# EAGLE design Adafruit ItsyBitsy nRF52840 Express (EAGLE 9.5.1)
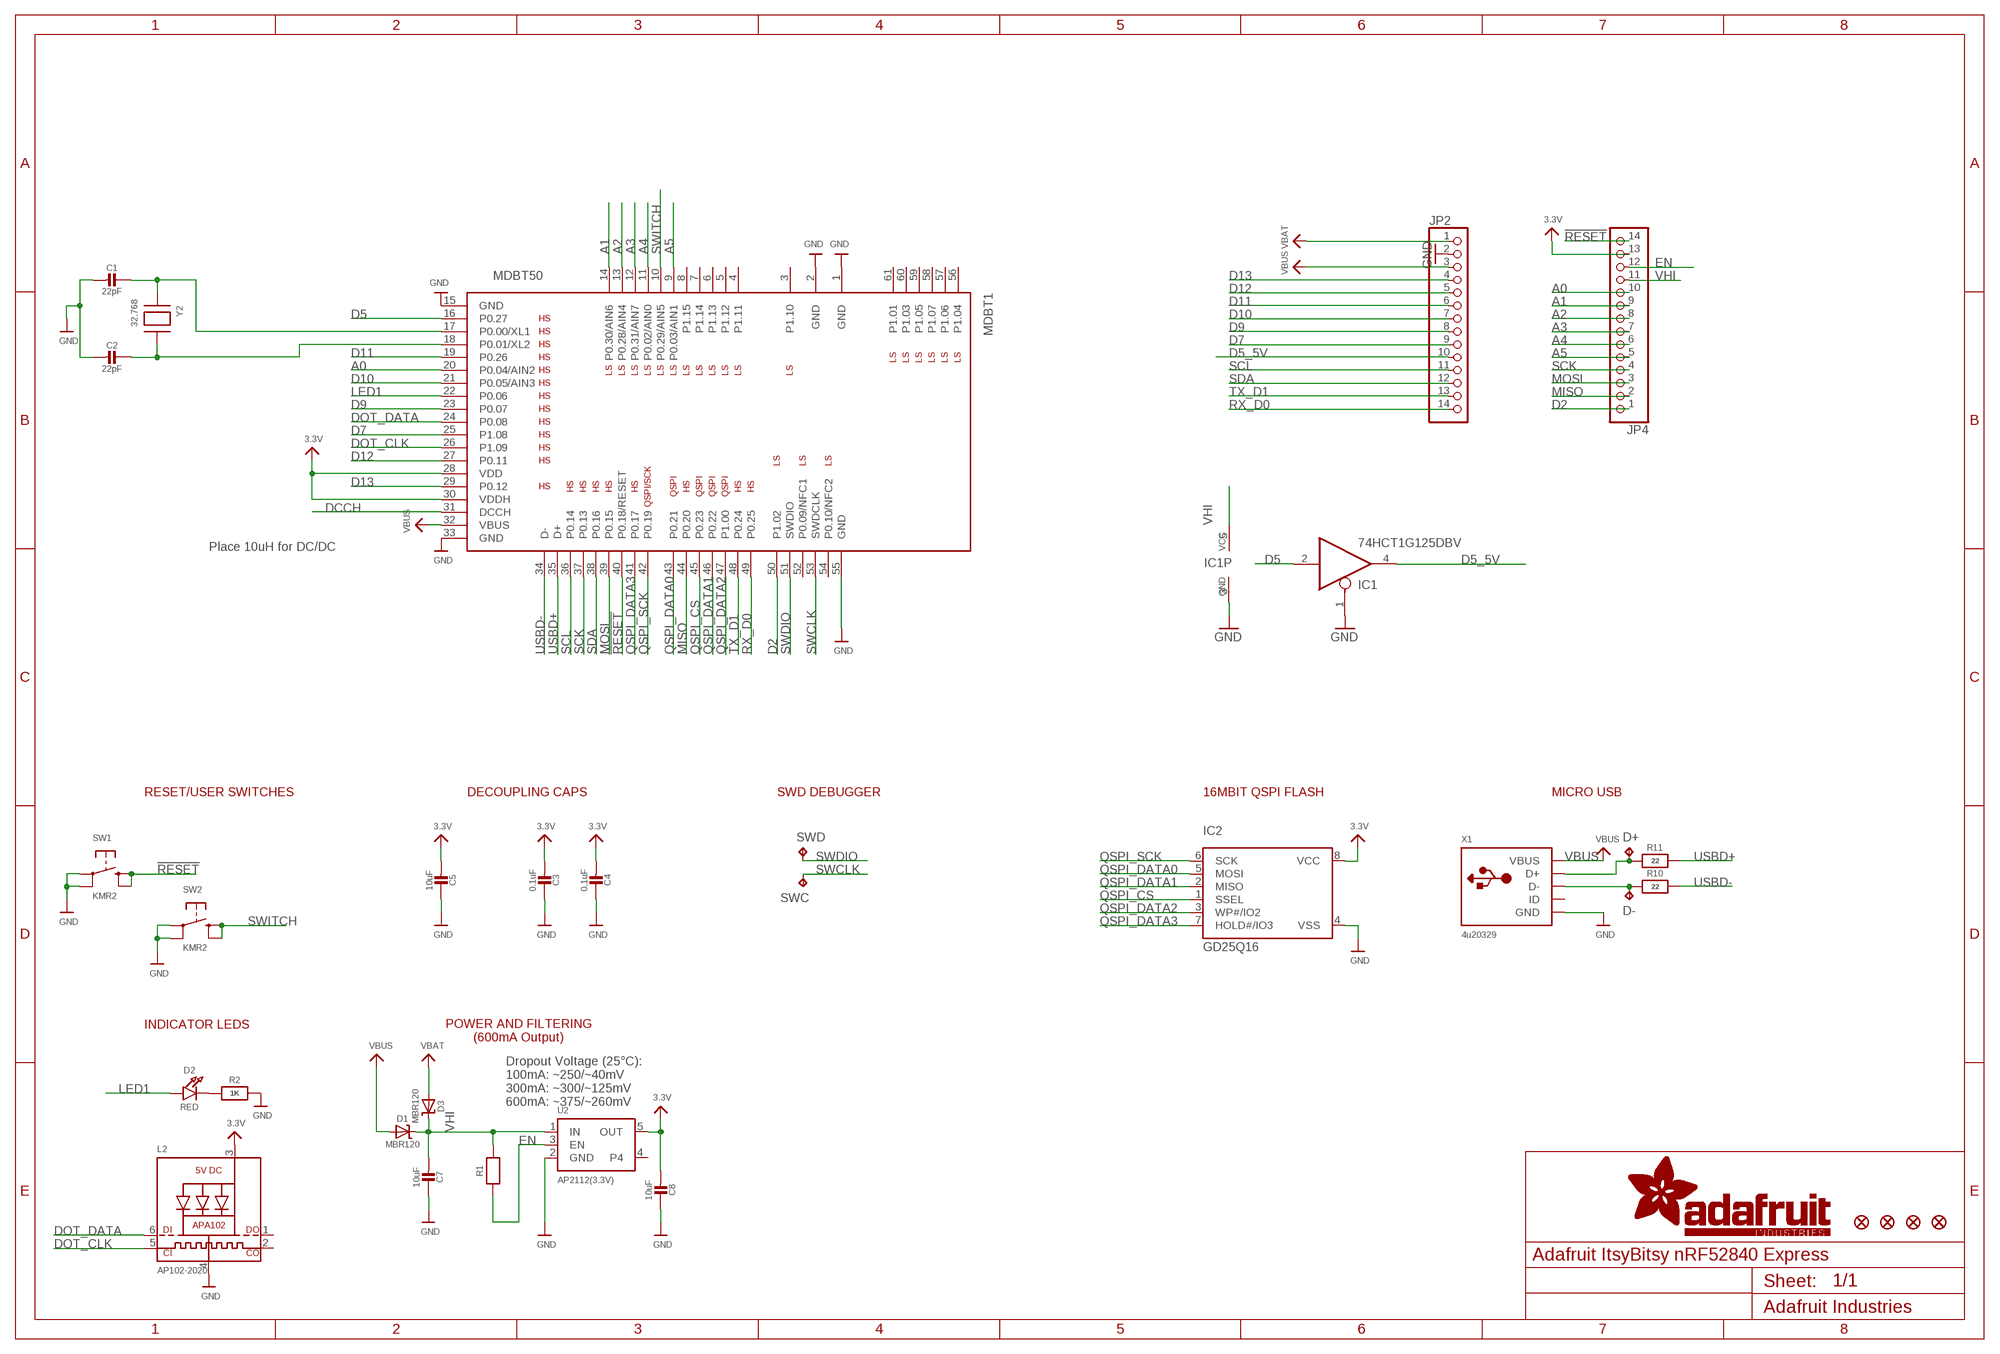
[diagram p0: schematic, sheet 1]

## Parts
C1  22pF  CAP_CERAMIC_0603MP  [_0603MP]
C2  22pF  CAP_CERAMIC_0603MP  [_0603MP]
C3  0.1uF  CAP_CERAMIC0603_NO  [0603-NO]
C4  0.1uF  CAP_CERAMIC0603_NO  [0603-NO]
C5  10uF  CAP_CERAMIC0805-NOOUTLINE  [0805-NO]
C7  10uF  CAP_CERAMIC0805-NOOUTLINE  [0805-NO]
C8  10uF  CAP_CERAMIC0805-NOOUTLINE  [0805-NO]
D1  MBR120  DIODE-SCHOTTKYSOD-123  [SOD-123]
D2  RED  LED0805_NOOUTLINE  [CHIPLED_0805_NOOUTLINE]
D3  MBR120  DIODE-SCHOTTKYSOD-123  [SOD-123]
D+  TPTP10R  [TP10R]
D-  TPTP10R  [TP10R]
FID1  FIDUCIAL_1MM  [FIDUCIAL_1MM]
FID2  FIDUCIAL_1MM  [FIDUCIAL_1MM]
FID3  FIDUCIAL_1MM  [FIDUCIAL_1MM]
FID4  FIDUCIAL_1MM  [FIDUCIAL_1MM]
IC1  74HCT1G125DBV  74AHC1G125DBV  [SOT23-5]
IC2  GD25Q16  SPIFLASH_8PINUX  [USON8]
JP2  HEADER-1X14  [1X14_ROUND70]
JP4  HEADER-1X14  [1X14_ROUND70]
L2  AP102-2020  APA1022020  [APA102_2020]
MDBT1  MDBT50  [MDBT50]
R1  10K  RESISTOR_0603_NOOUT  [0603-NO]
R2  1K  RESISTOR_0603_NOOUT  [0603-NO]
R10  22  RESISTOR_0603_NOOUT  [0603-NO]
R11  22  RESISTOR_0603_NOOUT  [0603-NO]
SW1  KMR2  SWITCH_TACT_SMT4.6X2.8  [BTN_KMR2_4.6X2.8]
SW2  KMR2  SWITCH_TACT_SMT4.6X2.8  [BTN_KMR2_4.6X2.8]
SWC  TPTP13R  [TP13R]
SWD  TPTP13R  [TP13R]
U2  AP2112(3.3V)  VREG_SOT23-5  [SOT23-5]
X1  4u20329  USB_MICRO_20329_V2  [4UCONN_20329_V2]
Y2  32.768  XTAL-3.2X1.5  [XTAL3215]

## Nets
3.3V [power]: C3.2 C4.2 C5.2 C8.2 IC2.8(VCC) JP4.13 L2.3(VDD) MDBT1.28(VDD) MDBT1.30(VDDH) U2.5(OUT)
!RESET: JP4.14 MDBT1.40(P0.18/RESET) SW1.B'(S1) SW1.B(S)
A0: JP4.10 MDBT1.20(P0.04/AIN2)
A1: JP4.9 MDBT1.14(P0.30/AIN6)
A2: JP4.8 MDBT1.13(P0.28/AIN4)
A3: JP4.7 MDBT1.12(P0.31/AIN7)
A4: JP4.6 MDBT1.11(P0.02/AIN0)
A5: JP4.5 MDBT1.9(P0.03/AIN1)
D2: JP4.1 MDBT1.50(P1.02)
D5: IC1.2(I) MDBT1.16(P0.27)
D5_5V: IC1.4(O) JP2.10
D7: JP2.9 MDBT1.25(P1.08)
D9: JP2.8 MDBT1.23(P0.07)
D10: JP2.7 MDBT1.21(P0.05/AIN3)
D11: JP2.6 MDBT1.19(P0.26)
D12: JP2.5 MDBT1.27(P0.11)
D13: JP2.4 MDBT1.29(P0.12)
D+: D+.TP R11.1 X1.D+
D-: D-.TP R10.1 X1.D-
DCCH: MDBT1.31(DCCH)
DOT_CLK: L2.5(CKI) MDBT1.26(P1.09)
DOT_DATA: L2.6(DI) MDBT1.24(P0.08)
EN: JP4.12 R1.1 U2.3(EN)
GND: C1.2 C2.2 C3.1 C4.1 C5.1 C7.1 C8.1 IC1.1(OE) IC1.3(GND) IC2.4(VSS) JP2.2 L2.4(GND) MDBT1.1(GND) MDBT1.2(GND) MDBT1.15(GND) MDBT1.33(GND) MDBT1.55(GND) R2.2 SW1.A'(P1) SW1.A(P) SW2.A'(P1) SW2.A(P) U2.2(GND) X1.BASE@1(GND) X1.BASE@2(GND) X1.GND X1.SPRT@1(GND) X1.SPRT@2(GND) X1.SPRT@3(GND) X1.SPRT@4(GND)
LED1: D2.A MDBT1.22(P0.06)
MISO: JP4.2 MDBT1.44(P0.20)
MOSI: JP4.3 MDBT1.39(P0.15)
N$1: D2.C R2.1
N$7: C1.1 MDBT1.17(P0.00/XL1) Y2.P$1
N$8: C2.1 MDBT1.18(P0.01/XL2) Y2.P$2
QSPI_CS: IC2.1(SSEL) MDBT1.45(P0.23)
QSPI_DATA0: IC2.5(MOSI) MDBT1.43(P0.21)
QSPI_DATA1: IC2.2(MISO) MDBT1.46(P0.22)
QSPI_DATA2: IC2.3(WP#/IO2) MDBT1.47(P1.00)
QSPI_DATA3: IC2.7(HOLD#/IO3) MDBT1.41(P0.17)
QSPI_SCK: IC2.6(SCK) MDBT1.42(P0.19)
RX_D0: JP2.14 MDBT1.49(P0.25)
SCK: JP4.4 MDBT1.37(P0.13)
SCL: JP2.11 MDBT1.36(P0.14)
SDA: JP2.12 MDBT1.38(P0.16)
SWCLK: MDBT1.53(SWDCLK) SWC.TP
SWDIO: MDBT1.51(SWDIO) SWD.TP
SWITCH: MDBT1.10(P0.29/AIN5) SW2.B'(S1) SW2.B(S)
TX_D1: JP2.13 MDBT1.48(P0.24)
USBD+: MDBT1.35(D+) R11.2
USBD-: MDBT1.34(D-) R10.2
VBAT [power]: D3.A JP2.1
VBUS [power]: D1.A JP2.3 MDBT1.32(VBUS) X1.VBUS
VHI [power]: C7.2 D1.C D3.C IC1.5(VCC) JP4.11 R1.2 U2.1(IN)
Unconnected: L2.1(DO) L2.2(CKO) MDBT1.3(P1.10) MDBT1.4(P1.11) MDBT1.5(P1.12) MDBT1.6(P1.13) MDBT1.7(P1.14) MDBT1.8(P1.15) MDBT1.52(P0.09/NFC1) MDBT1.54(P0.10/NFC2) MDBT1.56(P1.04) MDBT1.57(P1.06) MDBT1.58(P1.07) MDBT1.59(P1.05) MDBT1.60(P1.03) MDBT1.61(P1.01) U2.4 X1.ID

## Notes on the sheet
- Place 10uH for DC/DC
- RESET/USER SWITCHES | DECOUPLING CAPS | SWD DEBUGGER | 16MBIT QSPI FLASH | MICRO USB
- INDICATOR LEDS
- POWER AND FILTERING
  (600mA Output)
- Dropout Voltage (25°C):
  100mA: ~250/~40mV
  300mA: ~300/~125mV
  600mA: ~375/~260mV

## Library data of the parts
C1-C5 C7 C8 = microbuilder:CAP_CERAMIC: Ceramic Capacitors For new designs, use the packages preceded by an '_' character since they are more reliable: The following footprints should be used on most boards: _0402 - Standard footprint for regular board layouts _0603 - Standard footprint for regular board layouts _0805 - Standard footprint for regular board layouts _1206 - Standard footprint for regular board layouts For extremely tight-pitch boards where space is at a premium, the following 'micro-pitch' footprints can be used (smaller pads, no silkscreen outline, etc.): _0402MP - Micro-pitch footprint for very dense/compact boards _0603MP - Micro-pitch footprint for very dense/compact boards _0805MP - Micro-pitch footprint for very dense/compact boards _1206MP - Micro-pitch footprint for very dense/compact boards
D1 D3 = microbuilder:DIODE-SCHOTTKY
D2 = microbuilder:LED: LED 0603 - 0603 Surface Mount Package 2mA: Green LED - Low Power (3.9mcd, 2ma, 1.7Vf) - Digikey: 475-2709-2-ND Orange LED - Low Power (9.8mcd, 2ma, 1.8Vf) - Digikey: 475-1194-2-ND Red LED - Low Power (5mcd, 2ma, 1.8Vf) - Digikey: 475-1195-2-ND Yellow LED - Low Power (7mcd, 2ma, 1.8Vf) - Digikey: 475-1196-2-ND 5mA: Blue LED - Low Power (17mcd, 5ma, 2.9Vf) - Digikey: LNJ937W8CRACT-ND 0805 - 0805 Surface Mount Package 2mA: Red LED (8.8mcd, 2mA, 1.8Vf, Clear) - Low Power [Digikey: 475-2510-1-ND] Green LED (5mcd, 2mA, 1.8Vf, Clear) - Low Power [Digikey: 475-2730-1-ND] Yellow LED (11.3mcd, 2mA, 1.8Vf, Clear) - Low Power [Digikey: 475-2555-1-ND] 20mA: Red LED (104mcd, 20mA, Diffused) - LS R976 [Digikey: 475-1278-6-ND] Red LED (12mcd, 20mA, 2.0Vf, Clear) - APT2012EC [Digikey: 754-1128-1-ND] Green LED (15mcd, 20mA, 2.2Vf, Clear) - APT2012GC [Digikey: 754-1131-1-ND] Orange LED (160mcd, 20mA, 2.1Vf, Clear) - APT2012SECK [Digikey: 754-1130-1-ND] 1206 - 1206 Surface Mount Package Green LED (26mcd, 20mA, Diffused) - LG N971 [Digikey: 475-1407-6-ND] Red LED (15mcd, 20mA, Diffused) - LH N974 [Digikey: 475-1416-6-ND] Cree - Cree High-Power Surface Mount LEDs XPEBWT-L1-0000-00D50 - White 111lm 350mA 2.9Vf 6200K 110° XTEAWT-00-0000-00000LEE3 - White 114lm 350mA 2.85Vf 5000K 115° Everlight - Everlight 45-21 Series Surface Mount LEDs 45-21/QK2C-B2832AC2CB2/2T - Warm White 2000mcd 20mA 3.25Vf 3050K 120° 45-21/LK2C-B38452C4CB2/2T - Nuetral White 2000mcd 20mA 3.25Vf 4150K 120° 45-21/LK2C-B50634C6CB2/2T - Cold White 2200mcd 20mA 3.25Vf 5650K 120° PLCC2 Reverse Mount LS T77K-J1L2-1-0-2-R18-Z - Red 11.25mcd 2mA 1.8Vf 630nm 120° LO T77K-L1M2-24-Z - Orange 19.6mcd 2mA 1.8Vf 606nm 120° LY T77K-K2M1-26-Z - Yellow 15.7mcd 2mA 1.8Vf 587nm 120°
D+ D- SWC SWD = testpad:TP: Test pad
FID1-FID4 = microbuilder:FIDUCIAL: Fiducial Alignment Points Various fiducial points for machine vision alignment.; BOM: EXCLUDE
IC1 = 74xx-little-us:74*1G125: Single Bus Buffer Gate with 3-State Output
IC2 = microbuilder:SPIFLASH_8PIN: SOIC8 SPI Flash Be careful with the size since SOIC8 flash comes in several 'widths' SOIC8 150 mil M25P16 - 16Mbit (2Mbit x 8) Serial Flash (75MHz SPI Bus), Supply: 2.7-3.6V Digikey: SOIC8 - M25P16-VMN6P-ND SOIC8 208 mil W25Q16BVSSIG - 16Mbit (2Mbit x 8) Serial Flash (104MHz SPI Bus), Supply: 2.7-3.6V Digikey: SOIC8 - W25Q16BVSSIG-ND
JP2 JP4 = microbuilder:HEADER-1X14
L2 = microbuilder:APA102: APA102/DotStar Pixels VCC: 5V DC Refresh Rate: 400Hz
MDBT1 = microbuilder:MDBT50: Raytac Corporation MDBT50 Bluetooth Low Energy Module based on Noridc nRF52840 Source: Raytac datasheet
R1 R2 R10 R11 = microbuilder:RESISTOR: Resistors For new designs, use the packages preceded by an '_' character since they are more reliable: The following footprints should be used on most boards: _0402 - Standard footprint for regular board layouts _0603 - Standard footprint for regular board layouts _0805 - Standard footprint for regular board layouts _1206 - Standard footprint for regular board layouts For extremely tight-pitch boards where space is at a premium, the following 'micro-pitch' footprints can be used (smaller pads, no silkscreen outline, etc.): _0402MP - Micro-pitch footprint for very dense/compact boards _0603MP - Micro-pitch footprint for very dense/compact boards _0805MP - Micro-pitch footprint for very dense/compact boards _1206MP - Micro-pitch footprint for very dense/compact boards
SW1 SW2 = microbuilder:SWITCH_TACT_SMT: SMT Tact Switches 6x6mm - Digikey: P12940SCT-ND KMR2 (4.6x2.8mm) - Digikey: 401-1426-1-ND EVQ-PQHB55 - Light Touch, 160GF (4.5x4.5mm) - Digikey: P8090SCT-ND KMT0 - KMT021 NGJ LHS (etc.) IP68/Waterproof - Digikey: CKN10289CT-ND
U2 = microbuilder:VREG_SOT23-5: SOT23-5 Fixed Voltage Regulators Part Current Out V Out V In V Dropout θJA (°C/W) TJ (°C) Digikey Part No. ADP121 150mA 3.3V 3.4-5.5V 0.09V @ 150mA -- -- ADP121-AUJZ33R7CT-ND ADP121 150mA 3.0V 3.1-5.5V 0.09V @ 150mA -- -- ADP121-AUJZ30R7CT-ND ADP122 300mA 3.3V 3.4-5.5V 0.085V @ 300mA -- -- ADP122AUJZ-3.3-R7CT-ND ADP1712 300mA 3.3V 3.5-5.5V 0.17V @ 300mA -- -- ADP1712AUJZ-3.3-R7TR-ND AP7311 (Low Cost) 150mA 3.3V 3.5-6V 0.15V @ 150mA -- -- AP7311-33WG-7DICT-ND LD39015M18R 150mA 1.8V 1.9V-5.5V 0.08V @ 100mA -- -- 497-6977-1-ND LP2985A-33DBVR 150mA 3.3V 3.3-16V 0.28V @ 150mA 206 150 296-18479-1-ND MCP1824T-3302E/OT 300mA 3.3V 3.5V-6V 0.2V @ 300mA -- -- MCP1824T-3302E/OTCT-ND MIC5205-2.5YM5 TR 150mA 2.5V 2.7-16V 0.165V @ 150mA -- -- 576-1257-2-ND MIC5205-3.0YM5 TR 150mA 3.0V 3.2V-16V 0.165V @ 150mA -- -- 576-1258-2-ND MIC5205-3.3YM5 TR 150mA 3.3V 3.5V-16V 0.165V @ 150mA -- -- 576-1259-2-ND TPS780330220 150mA 3.3V+2.2V 3.6-5.5V 250mV Max -- -- 296-23332-1-ND TDA3663/N1,135 100mA 3.3V 3.5-45V 0.18V @ 50mA -- -- 568-5343-1-ND Max operating temp can be calculated using θJA, TJ (max junction temperature), and power in watts. Set the "Maximum Ambient Temperature" until it reaches TJ ("Max Junction Temperature"), which is the absolute limit for safe use of the regulator: Heat Sink Temperature Calculator <http://www.daycounter.com/Calculators/Heat-Sink-Temperature-Calculator.phtml> For example, With 12V source into a 3.3V LP2985 and a 30mA load, we are dissipating (12V-3.3V) * 0.03A = 0.261W. With a θJA of 206 °C/W, a TJ of 150°C, and 261mW we can safely use the chip without a heat sink up to 75°C (=147.1°C Junction Temperature).
X1 = microbuilder:USB: USB Connectors USBMINIB - Surface Mount Female Mini-B USB Connector 4UConnector: 06564
Y2 = adafruit2:XTAL: Low cost SMT crystals, no capacitors included http://www.ladyada.net/library/eagle

## Net classes
1 power: width 0.254 mm

## Board
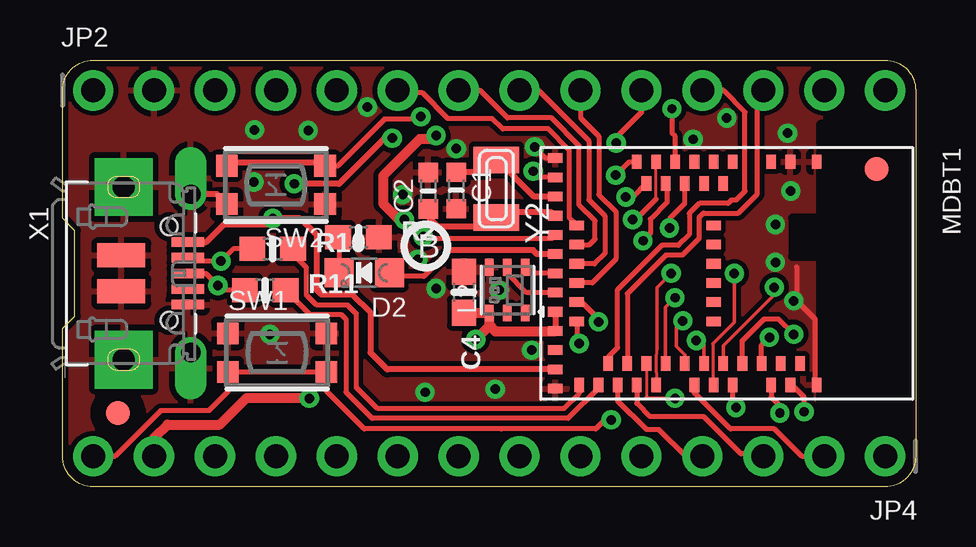
[diagram p1: board, top side]
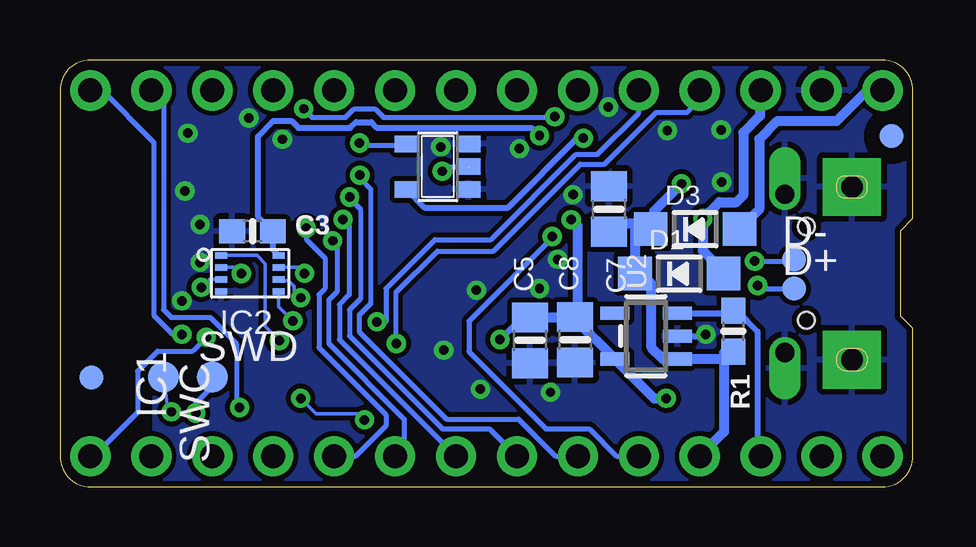
[diagram p2: board, bottom side, seen from below]

Size 35.56 x 17.78 mm. Coordinates in mm from the lower left corner, seen from the top.
Outline: 0,11.18 0,16.51 arc-90 1.27,17.78 34.29,17.78 arc-90 35.56,16.51 35.56,1.27 arc-90 34.29,0 1.27,0 arc-90 0,1.27 0,6.6 0.51,7.11 0.51,10.67 0,11.18
Copper layers (1*16): Top 0.035mm / dielectric 1.5mm / Bottom 0.035mm
Design rules "adafruit 7-7": minimum track width 6mil, minimum drill 15.5mil, track to track 8mil, track to pad 7mil, pad to pad 7mil, via to via 7mil, smd to smd 7mil, copper to edge 10mil, drill to drill 8mil, minimum pad ring 10mil, minimum via ring 8mil, stop-mask expansion 2mil, vias tented up to drill 20mil, thermal gap 10mil

### Footprints (pad centres in the part's own frame; a part is rotated, then mirrored left to right if it is on the bottom)
_0603MP = smd 0.8 x 0.8: 1 -0.762,0; 2 0.762,0
0603-NO = smd 1.075 x 1: 1 -0.85,0; 2 0.85,0
0805-NO = smd 1.24 x 1.5: 1 -0.95,0; 2 0.95,0
SOD-123 = smd 1.4 x 1.4: A 1.85,0; C -1.85,0
CHIPLED_0805_NOOUTLINE = smd 1.2 x 1.2: A 0,-1.05; C 0,1.05
TP10R = smd 1 x 1: TP 0,0
FIDUCIAL_1MM = smd 1 x 1: 1 0,0
SOT23-5 = smd 0.69 x 0.99: 1 -0.95,-1.29; 2 0,-1.29; 3 0.95,-1.29; 4 0.95,1.3; 5 -0.95,1.3
USON8 = smd 0.5 x 0.275: 1 -1.2,0.75; 2 -1.2,0.25; 3 -1.2,-0.25; 4 -1.2,-0.75; 5 1.2,-0.75; 6 1.2,-0.25; 7 1.2,0.25; 8 1.2,0.75
1X14_ROUND70 = drill 1 pad 1.676: 1 -16.51,0; 2 -13.97,0; 3 -11.43,0; 4 -8.89,0; 5 -6.35,0; 6 -3.81,0; 7 -1.27,0; 8 1.27,0; 9 3.81,0; 10 6.35,0; 11 8.89,0; 12 11.43,0; 13 13.97,0; 14 16.51,0
APA102_2020 = smd 0.7 x 0.35: 1 -0.95,-0.75; 2 -0.95,0; 3 -0.95,0.75; 4 0.95,0.75; 5 0.95,0; 6 0.95,-0.75
MDBT50 = smd 0.6 x 0.4: 1 -4.65,3.75; 2 -4.65,2.65; 3 -4.65,1.85; 4 -4.65,0.25; 5 -3.75,-0.15; 6 -4.65,-0.55; 7 -3.75,-0.95; 8 -4.65,-1.35; 9 -3.75,-1.75; 10 -4.65,-2.15; 11 -3.75,-2.55; 12 -4.65,-2.95; 13 -3.75,-3.35; 14 -4.65,-3.75; 34 4.65,-6.15; 35 4.65,-5.35; 36 3.75,-4.95; 37 4.65,-4.55; 38 3.75,-4.15; 39 4.65,-3.75; 40 3.75,-3.35; 41 4.65,-2.95; 42 3.75,-2.55; 43 3.75,-1.75; 44 4.65,-1.35; 45 3.75,-0.95; 46 4.65,-0.55; 47 3.75,-0.15; 48 4.65,0.25; 49 3.75,0.65; 50 3.75,1.45; 51 4.65,1.85; 52 3.75,2.25; 53 4.65,2.65; 54 3.75,3.05; 55 4.65,3.75 | smd 0.4 x 0.6: 15 -4.8,-7.15; 16 -4,-7.15; 17 -3.2,-7.15; 18 -2.4,-7.15; 19 -2,-6.25; 20 -1.6,-7.15; 21 -1.2,-6.25; 22 -0.8,-7.15; 23 -0.4,-6.25; 24 0,-7.15; 25 0.4,-6.25; 26 0.8,-7.15; 27 1.2,-6.25; 28 1.6,-7.15; 29 2,-6.25; 30 2.4,-7.15; 31 3.2,-7.15; 32 4,-7.15; 33 4.8,-7.15; 56 -2,-0.55; 57 -1.2,-0.55; 58 -0.4,-0.55; 59 0.4,-0.55; 60 1.2,-0.55; 61 2,-0.55
BTN_KMR2_4.6X2.8 = smd 0.9 x 0.9: A 2.05,0.8; A' -2.05,0.8; B 2.05,-0.8; B' -2.05,-0.8
TP13R = smd 1.3 x 1.3: TP 0,0
SOT23-5' = smd 0.55 x 1.2: 1 -0.95,-1.3; 2 0,-1.3; 3 0.95,-1.3; 4 0.95,1.3; 5 -0.95,1.3
4UCONN_20329_V2 = smd 1 x 2: BASE@1 -0.75,-2; BASE@2 0.75,-2 | smd 0.4 x 1.35: D+ 0,0.775; D- -0.65,0.775; GND 1.3,0.775; ID 0.65,0.775; VBUS -1.3,0.775 | drill 0.8 pad 1.143 offset: SPRT@1 -3.3,0.9; SPRT@2 3.3,0.9 | drill 0.9 pad 2.413 square: SPRT@3 -3.6,-1.9; SPRT@4 3.6,-1.9 | hole 0.7: -1.95,0; 1.95,0
XTAL3215 = smd 1.1 x 1.9: P$1 1.2,0; P$2 -1.2,0

### Placement (x,y rotation side)
C1  16.41,12.34 270 top
C2  15.24,12.33 90 top
C3  27.53,10.64 0 bottom
C4  16.73,8.1 270 top
C5  15.96,6.1 90 bottom
C7  12.67,11.57 270 bottom
C8  14.08,6.12 90 bottom
D1  9.74,8.88 0 bottom
D2  12.57,8.92 90 top
D3  9.08,10.73 0 bottom
D+  4.95,8.26 0 bottom
D-  4.95,9.46 0 bottom
FID1  2.31,3.07 0 top
FID2  33.93,13.25 0 top
FID3  0.89,14.61 0 bottom
FID4  34.24,4.55 0 bottom
IC1  19.81,13.34 90 bottom
IC2  27.64,8.89 0 bottom
JP2  17.78,16.51 0 top
JP4  17.78,1.27 180 top
L2  18.54,8.19 90 top
MDBT1  27.69,8.89 270 top
R1  7.49,6.48 270 bottom
R2  12.33,10.39 0 top
R10  8.76,9.91 0 top
R11  8.45,8.19 0 top
SW1  8.94,5.59 0 top
SW2  8.89,12.57 180 top
SWC  31.24,4.57 270 bottom
SWD  29.21,4.57 0 bottom
U2  AP2112(3.3V)  [SOT23-5']  11.13,6.27 90 bottom
U$12  [ITSYNRF52840_TOP]  0,0 0 top
U$14  [ITSYNRF52840_BOT]  35.56,0 0 bottom
U$15  [PCBFEAT-REV-040]  15.14,10.03 0 top
X1  4.45,8.89 270 top
Y2  18.08,12.42 90 top

### Tracks (layer width: path | path; a pad name or v marks a point on that pad's centre or on a via)
3.3V  (via drill 0.39)
  Top 0.254: L2.3 17.79,6.72 | 20.52,6.48 MDBT1.30 MDBT1.28 | 17.78,7.25 L2.3 | 17.77,6.64 17.73,6.64 | L2.3 17.77,7.22 | v15.57,14.63 15.57,14.61
  Top 0.406: 17.79,6.72 18.03,6.48 20.52,6.48 | C4.2 17.78,7.25 | JP4.13 3.81,2.03 4.37,2.59 6.55,2.59 7.64,3.68 v10.29,3.68 | v17.22,6.13 17.73,6.64 | 17.77,7.22 17.77,6.64 | 15.57,14.61 15.44,14.48 14.88,14.48 13.36,12.95 13.36,11.8 14.03,11.12 v14.25,11.12
  Bottom 0.254: IC2.8 26.68,9.89 C3.2 27.32,11.28 27.32,14.59 26.67,15.24 25.91,15.24 25.62,14.95 23.46,14.95 23.22,15.19 22.58,15.19 22.35,14.96 15.89,14.95 v15.57,14.63 | U2.5 | 15.94,7.07 C5.2 16.31,7.05 v17.22,6.13 | 14.08,6.98 C8.2 13.98,7.17
  Bottom 0.406: U2.5 10.79,3.68 v10.29,3.68 | 15.94,7.07 C8.2 | 14.08,6.98 U2.5 | 13.98,7.17 13.98,10.86 v14.25,11.12
!RESET  (via drill 0.39)
  Top 0.127: MDBT1.40 24.34,3.73
  Top 0.152: 24.34,3.73 24.38,3.68 v25.53,3.68 | 18.3,2.41 18.29,2.41
  Top 0.203: v22.87,2.79 22.61,2.79 22.23,2.41 18.3,2.41 | 18.29,2.41 12.57,2.41 10.99,4 SW1.B SW1.B' 6.89,3.97 6.1,3.17 4.09,3.17 2.18,1.27 JP4.14
  Bottom 0.152: v25.53,3.68 24.89,3.05 23.13,3.05 v22.87,2.79
A0  (via drill 0.39)
  Top 0.203: MDBT1.20 20.38,10.34 15.13,10.34 v15.04,10.43
  Bottom 0.203: v15.04,10.43 15.04,10.38 18.52,6.9 18.52,5.63 15.3,2.41 13.5,2.41 12.35,1.27 JP4.10
A1  (via drill 0.39)
  Top 0.203: MDBT1.14 23.62,13.54 v23.06,12.98
  Bottom 0.203: v23.06,12.98 23.06,12.85 22.61,12.4 22.61,7.62 23.09,7.14 23.09,6.46 19.45,2.82 16.44,2.82 14.89,1.27 JP4.9
A2  (via drill 0.39)
  Top 0.203: v23.48,12.07 23.77,12.07 MDBT1.13
  Bottom 0.203: v23.48,12.07 23.48,12.01 23.04,11.57 23.04,7.82 23.5,7.37 23.5,6.29 19.62,2.41 17.65,2.41 JP4.8
A3  (via drill 0.39)
  Top 0.127: MDBT1.12 24.74,11.98
  Top 0.203: 24.74,11.98 23.89,11.13 v23.76,11.13
  Bottom 0.203: v23.76,11.13 23.51,10.88 23.51,8 23.91,7.59 23.91,6.13 JP4.7
A4  (via drill 0.39)
  Top 0.203: MDBT1.11 25.2,12.58 25.2,11.85 24.5,11.15 24.5,10.55 v24.19,10.25
  Bottom 0.203: v24.19,10.25 24,10.06 24,8.13 24.36,7.77 24.36,5.97 21.21,2.82 21.21,1.65 JP4.6
A5  (via drill 0.39)
  Top 0.203: v25.3,10.78 25.3,11.16 25.94,11.8 MDBT1.9
  Bottom 0.203: v25.3,10.78 25.3,10.31 24.51,9.53 24.51,8.26 24.77,8 24.77,5.79 21.97,3 21.97,2.54 23.24,1.27 JP4.5
D2  (via drill 0.39)
  Top 0.203: MDBT1.50 29.14,5.89 v29.46,6.22
  Bottom 0.203: v29.46,6.22 30.04,5.65 31.49,5.65 32.33,4.82 32.33,3.11 34.16,1.27 JP4.1
D5  (via drill 0.39)
  Top 0.203: MDBT1.16 19.88,12.89 v19.62,13.14
  Bottom 0.203: v19.62,13.14 19.43,13.34 IC1.2
D5_5V  (via drill 0.39)
  Top 0.203: JP2.10 24.13,15.6 23.08,14.54 v23.08,14.33
  Bottom 0.203: v23.08,14.33 22.97,14.33 22.86,14.22 21.18,14.22 IC1.4
D7
  Top 0.203: MDBT1.25 22.08,8.49 23.06,9.47 23.06,11.47 22.36,12.17 22.36,14.6 21.59,15.37 JP2.9
D9
  Top 0.203: JP2.8 19.84,16.51 21.94,14.41 21.94,11.95 22.6,11.29 22.6,9.71 22.18,9.29 MDBT1.23
D10
  Top 0.203: JP2.7 17.4,16.51 18.54,15.37 20.38,15.37 21.53,14.21 21.53,11.73 22.19,11.07 22.19,10.32 21.96,10.09 MDBT1.21
D11
  Top 0.203: JP2.6 14.07,16.41 14.99,16.41 16.06,15.34 17.91,15.34 18.34,14.91 20.26,14.91 21.12,14.05 21.12,11.21 MDBT1.19
D12  (via drill 0.39)
  Top 0.203: MDBT1.27 21.65,7.69 22.34,7 v22.34,6.87
  Bottom 0.203: v22.34,6.87 21.97,6.87 21.97,8.26 19.93,10.3 17.59,10.3 14.05,13.84 13.16,13.84 11.43,15.57 JP2.5
D13  (via drill 0.39)
  Top 0.203: MDBT1.29 21.44,6.07 v21.54,5.97
  Bottom 0.203: v21.54,5.97 21.57,6 21.57,8.07 19.82,9.82 17.49,9.82 13.87,13.44 12.86,13.44 10.7,15.6 9.42,15.6 8.89,16.13 JP2.4
D+  (via drill 0.39)
  Top 0.203: R11.1 6.79,8.19 6.6,8.38 v6.48,8.38 5.97,8.89 X1.D+
  Bottom 0.203: v6.48,8.38 6.35,8.26 D+.TP
D-  (via drill 0.39)
  Top 0.203: R10.1 7.11,9.91 v6.6,9.4 5.36,9.4 X1.D-
  Bottom 0.203: v6.6,9.4 5.02,9.4 D-.TP
DOT_CLK
  Top 0.203: MDBT1.26 19.34,8.09 18.54,8.89 L2.5
DOT_DATA
  Top 0.203: MDBT1.24 19.54,8.89 L2.6
EN
  Bottom 0.254: U2.3 7.6,7.22 R1.1 7.33,7.33 6.48,6.48 6.48,1.4 JP4.12
GND  (via drill 0.39)
  Top 0.203: MDBT1.55 31.37,4.31 31.37,6.99 30.61,7.75 30.61,9.16 | C1.2 16.41,11.8 | 15.24,12.92 C2.2 | MDBT1.15 20.16,13.69 v19.68,14.16
  Top 0.254: SW2.A 6.42,12.19 X1.SPRT@1
  Bottom 0.254: U2.2 8.71,6.27 v8.64,6.35
  other vias: 18.03,4.06 15.57,8.26 7.98,12.7 8,14.87 14.17,12.17 14.81,9.47 16.41,14.08 29.72,10.92 26.29,14.48 30.23,14.73 27.69,15.37 30.35,12.32 30.48,7.75 29.72,9.35 15.11,3.94 19.56,5.69 18.2,8.19 12.7,15.82 10.24,14.85
  pour Bottom (isolate 0.152): 0,0 31.62,0 31.62,17.78 0,17.78
  pour Top (isolate 0.152): 0,0 31.62,0 31.62,17.78 0,17.78
LED1
  Top 0.203: 16.15,9.86 15.06,8.76 13.78,8.76 D2.A
  Top 0.254: MDBT1.22 19.77,9.69 19.61,9.86 16.15,9.86
MISO
  Top 0.203: MDBT1.44 26.34,3.92 27.84,2.41 29.67,2.41 30.81,1.27 JP4.2
MOSI
  Top 0.203: MDBT1.39 23.94,3.48 24.49,2.92 26.73,2.92 28.28,1.37 29.11,1.37 JP4.3
N$1
  Top 0.203: R2.1 11.52,10.35 D2.C
N$7
  Top 0.254: C1.1 17.57,13.11 Y2.P$1 18.13,13.62 19.66,12.09 MDBT1.17
N$8
  Top 0.254: MDBT1.18 20.4,11.43 18.29,11.43 Y2.P$2 17.69,10.83 15.65,10.83 15.24,11.24 C2.1
QSPI_CS  (via drill 0.39)
  Top 0.152: MDBT1.45 26.74,6.03 26.67,6.1 v26.42,6.1
  Bottom 0.152: v26.42,6.1 27,6.68 27,9.3 27.34,9.64 IC2.1
QSPI_DATA0  (via drill 0.39)
  Top 0.152: MDBT1.43 25.94,5.5 25.58,5.86 25.58,6.64 v25.86,6.91
  Bottom 0.152: v25.86,6.91 26.43,7.49 IC2.5
QSPI_DATA1  (via drill 0.39)
  Top 0.127: MDBT1.46 27.14,5.94 27.11,5.96
  Top 0.152: v28,8.88 28,6.85 27.11,5.96
  Bottom 0.152: v28,8.88 v28,8.89 28.25,9.14 IC2.2
QSPI_DATA2  (via drill 0.39)
  Top 0.152: MDBT1.47 27.54,5.87 29.67,8 v29.67,8.31
  Bottom 0.152: v29.67,8.31 29.65,8.31 29.31,8.64 IC2.3
QSPI_DATA3  (via drill 0.39)
  Top 0.127: 24.77,4.27 24.77,4.74 24.75,4.76 24.75,5.52 24.77,5.54 24.77,5.71
  Top 0.152: v25.37,8.89 24.77,8.29 24.77,5.71 | 24.77,4.27 MDBT1.41
  Bottom 0.152: v25.37,8.89 25.62,9.14 IC2.7
QSPI_SCK  (via drill 0.39)
  Top 0.152: MDBT1.42 25.14,7.48 v25.53,7.87
  Bottom 0.152: v25.53,7.87 25.8,8.15 25.8,8.35 26.04,8.58 26.38,8.58 IC2.6
RX_D0  (via drill 0.39)
  Top 0.203: MDBT1.49 28.34,6.09 29.23,6.99 29.84,6.99 v30.48,6.35
  Bottom 0.203: v30.48,6.35 30.86,6.35 31.65,7.14 31.65,14.35 33.81,16.51 JP2.14
SCK
  Top 0.203: JP4.4 25.98,1.27 24.87,2.38 24.35,2.38 23.14,3.59 MDBT1.37
SCL
  Top 0.203: MDBT1.36 22.74,5.4 23.13,5.79 23.13,8.21 24.98,10.06 25.68,10.06 26.12,10.51 26.12,11.38 26.55,11.81 27.75,11.81 27.88,11.94 28.07,11.94 28.45,12.32 28.45,15.62 27.56,16.51 JP2.11
SDA
  Top 0.203: MDBT1.38 23.54,8.04 25.15,9.65 25.84,9.65 26.53,10.34 26.53,11.22 26.71,11.4 28.16,11.4 28.96,12.19 28.96,15.88 29.21,16.13 JP2.12
SWCLK  (via drill 0.39)
  Top 0.203: v30.91,3.12 30.91,3.73 30.41,4.24 MDBT1.53
  Bottom 0.152: SWC.TP 31.06,3.28 v30.91,3.12
SWDIO  (via drill 0.39)
  Top 0.203: MDBT1.51 29.54,3.73 30,3.26 v29.9,3.07
  Bottom 0.203: v29.9,3.07 29.9,3.48 29.17,4.21 SWD.TP
SWITCH  (via drill 0.39)
  Top 0.203: MDBT1.10 25.54,14.6 25.4,14.73 v25.4,15.75 | SW2.B' 11.47,13.37 13.42,15.32 14.83,15.32 v14.94,15.42
  Top 0.254: SW2.B 6.97,13.5 10.81,13.5 SW2.B'
  Bottom 0.203: v25.4,15.75 25.04,15.39 23.65,15.39 23.29,15.75 22.43,15.75 22.07,15.39 14.96,15.39 v14.94,15.42
TX_D1  (via drill 0.39)
  Top 0.203: MDBT1.48 27.92,4.22 27.92,3.45 v28.07,3.3
  Bottom 0.203: v28.07,3.3 28.2,3.43 28.2,5.96 29.3,7.05 30.93,7.05 31.24,7.37 31.24,16 JP2.13
USBD+
  Top 0.203: MDBT1.35 22.34,4.11 21.07,2.85 12.9,2.85 11.81,3.94 11.81,6.99 11.63,7.16 10.32,7.16 R11.2
USBD-
  Top 0.203: MDBT1.34 21.54,3.9 20.88,3.25 13.13,3.25 12.24,4.14 12.24,7.21 11.89,7.57 10.59,7.57 10.16,8 10.16,9.14 9.61,9.69 R10.2
VBAT
  Bottom 0.406: JP2.1 1.91,16.51 3.17,15.24 5.65,15.24 6.41,14.49 6.41,11.56 D3.A
VBUS  (via drill 0.39)
  Top 0.254: MDBT1.32 13.53,4.89 12.83,5.59 12.83,7.26 12.09,8 10.79,8 10.59,8.2 10.59,10.49 9.91,11.18 v8.76,11.18 8.51,10.92 6.71,10.92 5.98,10.19 X1.VBUS
  Bottom 0.254: D1.A 7.89,8.97 | JP2.3 6.38,16.48
  Bottom 0.406: 7.89,8.97 8.76,9.84 v8.76,11.18 8.08,11.86 7.35,11.86 7.07,12.14 7.07,14.76 6.38,15.46 6.38,16.48
VHI  (via drill 0.39)
  Top 0.254: v13.74,14.52 13.42,14.52 11.52,12.62 v9.66,12.62 v9.65,12.62
  Bottom 0.254: 11.59,9.14 D1.C | D3.C 10.93,10.91 10.77,11.07 10.38,11.07 10.38,10.95 10.79,10.95 | C7.2 12.35,10.95 | 7.49,5.98 7.14,5.63 7.3,5.32 | R1.2 7.49,5.98 | 7.49,5.98 7.87,5.6 | IC1.5 20.36,11.63 16.89,11.63 14,14.52 v13.74,14.52
  Bottom 0.406: 11.59,10.95 11.59,9.14 10.9,8.45 10.9,5.79 10.43,5.32 U2.1 7.3,5.32 | 11.59,10.95 10.79,10.95 10.79,11.48 v9.65,12.62 | 11.59,10.95 12.35,10.95 | JP4.11 7.87,2.29 7.87,5.6